# EAGLE design QFP32forZIF (EAGLE 6.3)
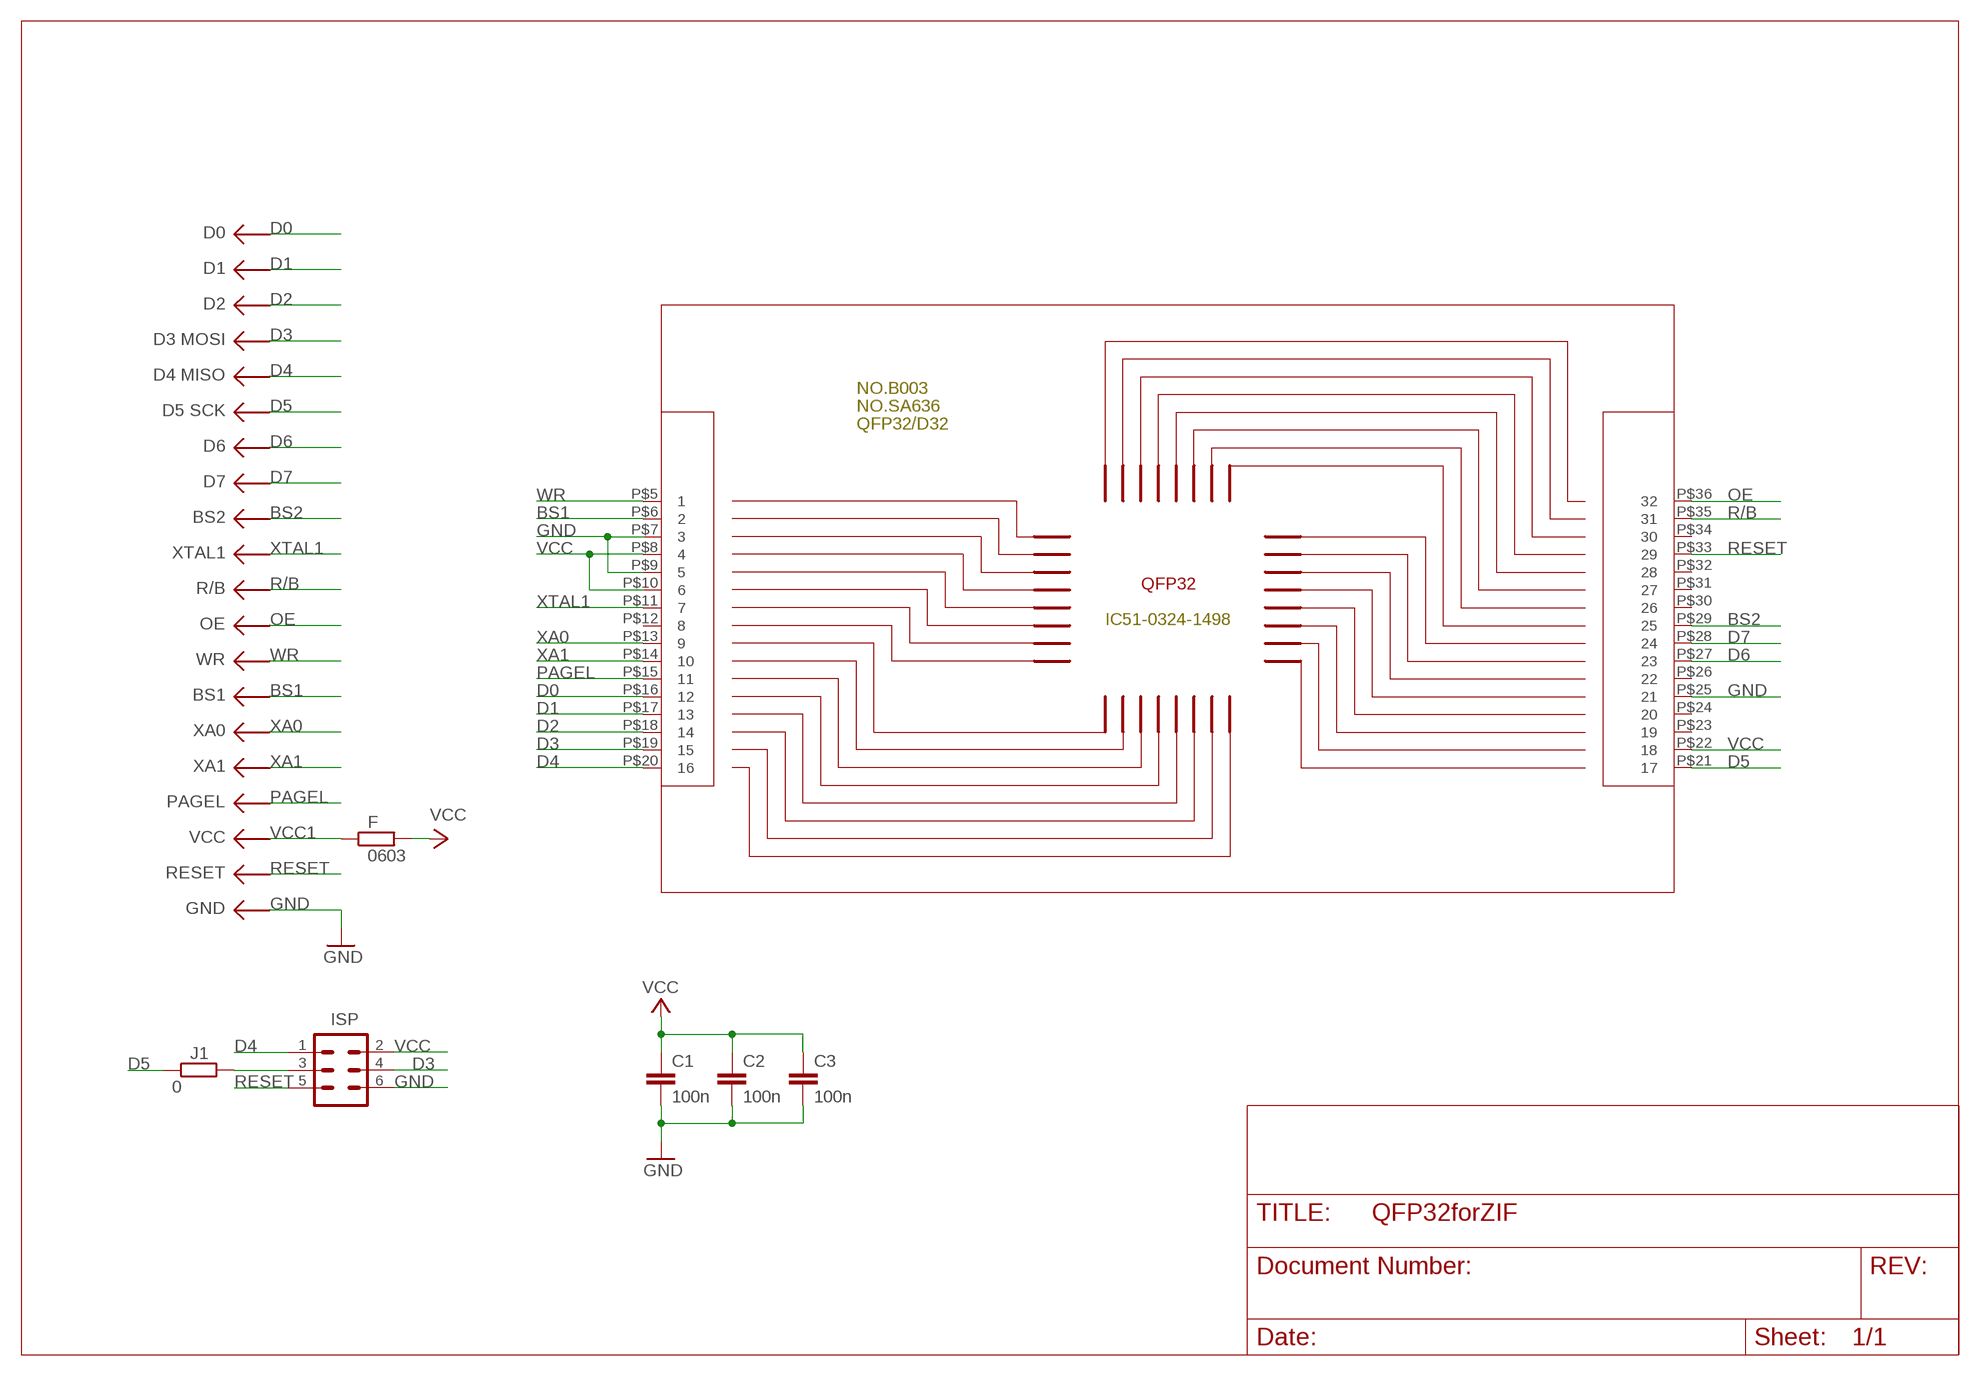
[diagram p0: schematic, sheet 1]

## Parts
C1  100n  RCL_C-EUC0805  [RCL_C0805]
C2  100n  RCL_C-EUC0805  [RCL_C0805]
C3  100n  RCL_C-EUC0805  [RCL_C0805]
F  0603  RCL_R-EU_M0805  [RCL_M0805]
ISP  MA03-2  [MA03-2]
J1  0  R-EU_R1206W  [R1206W]
U$1  PROGRAMMER_P_AVR  [PROGRAMMER_P_AVR]
U$14  SA636-40  [ADAPTERQFP48FORZIF]

## Nets
BS1: U$1.BS1 U$14.P$6
BS2: U$1.BS2 U$14.P$29
D0: U$1.D0 U$14.P$16
D1: U$1.D1 U$14.P$17
D2: U$1.D2 U$14.P$18
D3: ISP.4 U$1.D3 U$14.P$19
D4: ISP.1 U$1.D4 U$14.P$20
D5: J1.1 U$1.D5 U$14.P$21
D6: U$1.D6 U$14.P$27
D7: U$1.D7 U$14.P$28
GND: C1.2 C2.2 C3.2 ISP.6 U$1.GND U$1.GND01(GND) U$1.GND2(GND) U$1.GND03(GND) U$1.GND04(GND) U$1.GND05(GND) U$1.GND06(GND) U$1.GND07(GND) U$1.GND08(GND) U$1.GND09(GND) U$1.GND10(GND) U$1.GND11(GND) U$1.GND12(GND) U$1.GND13(GND) U$1.GND14(GND) U$1.GND15(GND) U$1.GND16(GND) U$1.GND17(GND) U$1.GND18(GND) U$1.GND19(GND) U$1.GND20(GND) U$1.GND21(GND) U$1.GND22(GND) U$14.P$7 U$14.P$9 U$14.P$25
N$6: ISP.3 J1.2
OE: U$1.OE U$14.P$36
PAGEL: U$1.PAGEL U$14.P$15
R/B: U$1.RB U$14.P$35
RESET: ISP.5 U$1.RESET U$14.P$33
VCC: C1.1 C2.1 C3.1 F.2 ISP.2 U$14.P$8 U$14.P$10 U$14.P$22
VCC1: F.1 U$1.VCC
WR: U$1.WR U$14.P$5
XA0: U$1.XA0 U$14.P$13
XA1: U$1.XA1 U$14.P$14
XTAL1: U$1.XTAL1 U$14.P$11
Unconnected: U$14.P$12 U$14.P$23 U$14.P$24 U$14.P$26 U$14.P$30 U$14.P$31 U$14.P$32 U$14.P$34

## Notes on the sheet
- NO.B003
- NO.SA636
- QFP32/D32
- IC51-0324-1498

## Library data of the parts
C1-C3 = HWProgUSB:RCL_C-EU: CAPACITOR, European symbol
F = HWProgUSB:RCL_R-EU_: RESISTOR, European symbol
ISP = con-lstb:MA03-2: PIN HEADER
J1 = rcl:R-EU_: RESISTOR, European symbol
U$1 = AdapterDIP_P:PROGRAMMER_P_AVR
U$14 = QFP32forZIF:SA636-40

## Board
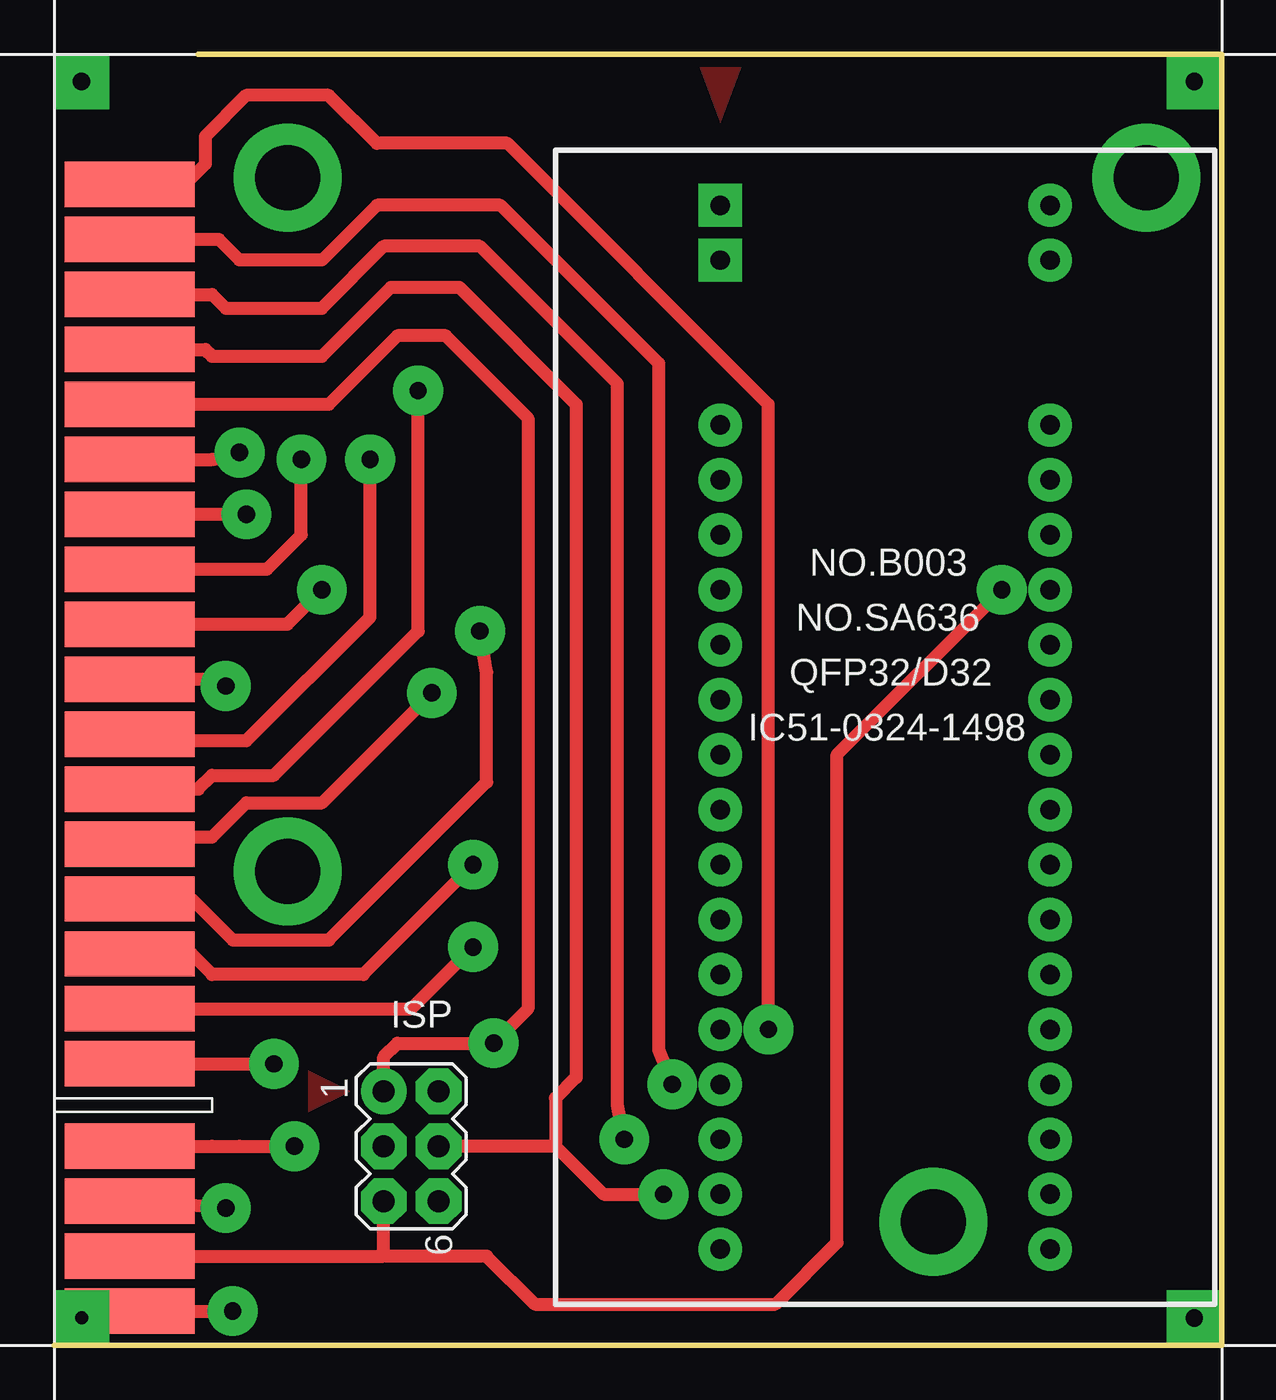
[diagram p1: board, top side]
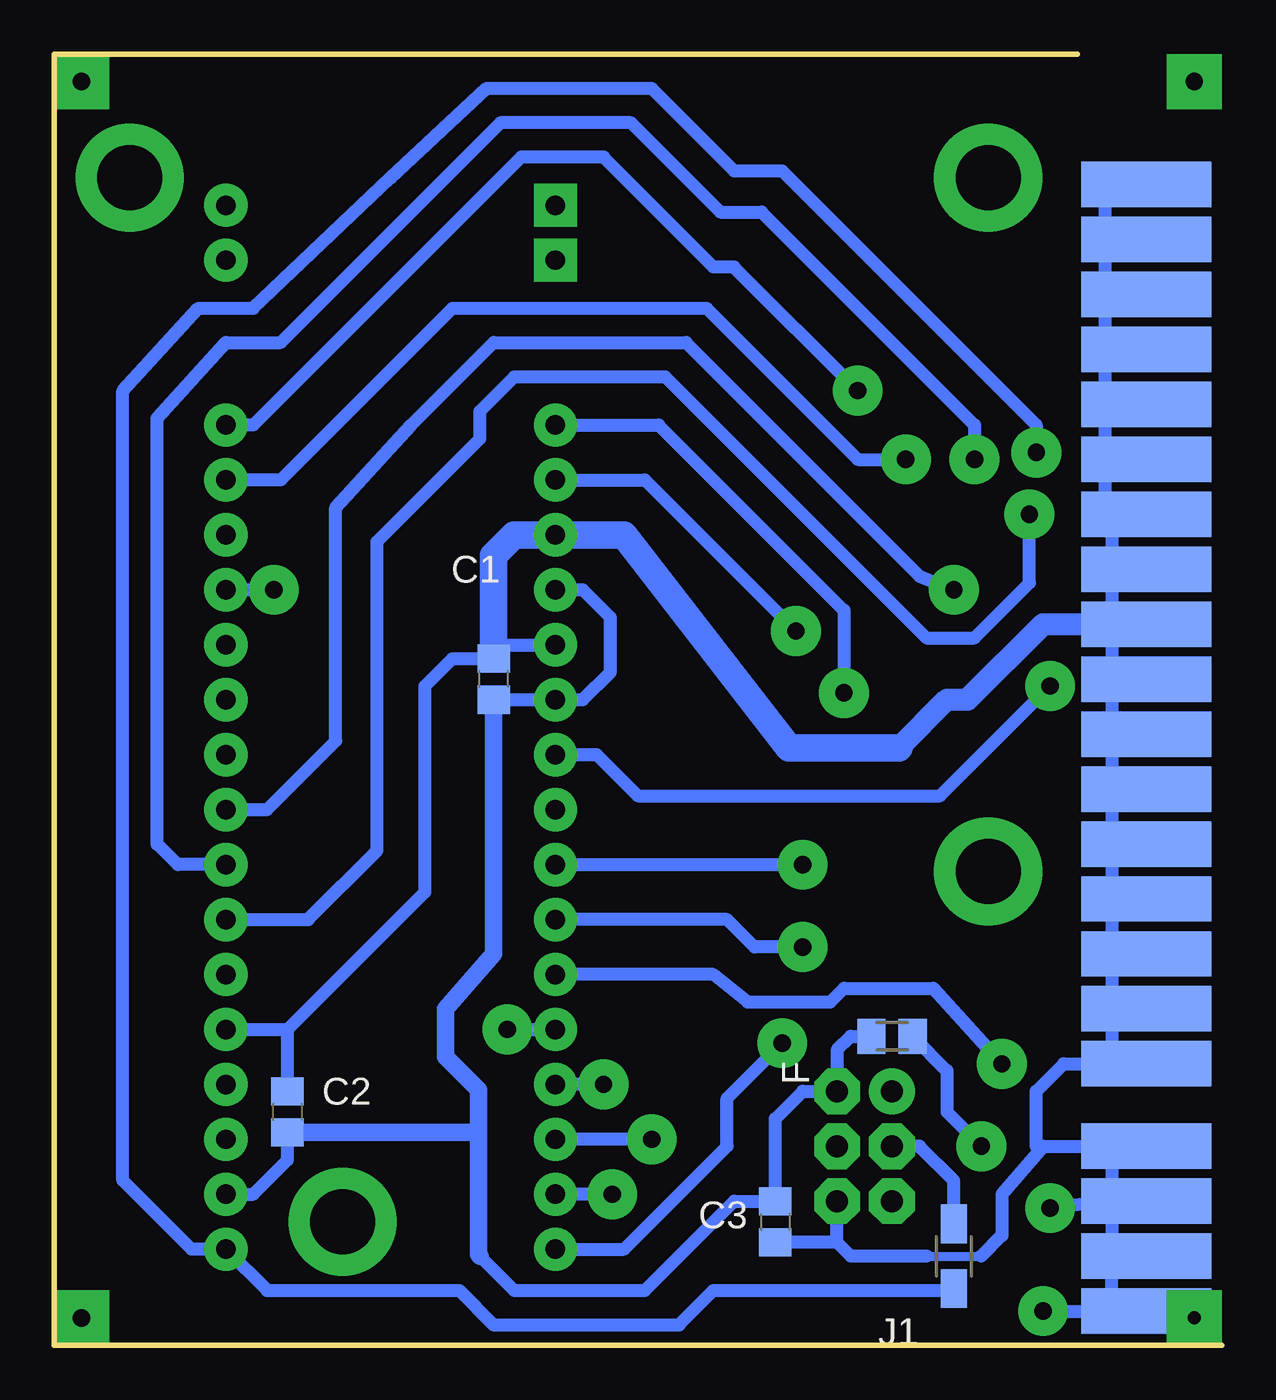
[diagram p2: board, bottom side, seen from below]

Size 53.98 x 59.69 mm. Coordinates in mm from the lower left corner, seen from the top.
Outline: 6.67,59.69 53.98,59.69 53.98,0 0,0
Copper layers (1*16): Top 0.035mm / dielectric 1.5mm / Bottom 0.035mm
Design rules "DesignRules": minimum track width 8mil, minimum drill 24mil, track to track 0.2mm, track to pad 0.2mm, pad to pad 8mil, via to via 8mil, smd to smd 8mil, copper to edge 10mil, drill to drill 8mil, minimum pad ring 0.55mm, minimum via ring 8mil, stop-mask expansion 4mil, vias tented up to drill 0mil, thermal gap 10mil

### Footprints (pad centres in the part's own frame; a part is rotated, then mirrored left to right if it is on the bottom)
RCL_C0805 = smd 1.3 x 1.5: 1 -0.95,0; 2 0.95,0
RCL_M0805 = smd 1.3 x 1.6: 1 -0.95,0; 2 0.95,0
MA03-2 = drill 1.016: 1 -2.54,-1.27 | drill 1.016 octagon: 2 -2.54,1.27; 3 0,-1.27; 4 0,1.27; 5 2.54,-1.27; 6 2.54,1.27
R1206W = smd 1.8 x 1.2: 1 -1.499,0; 2 1.499,0
PROGRAMMER_P_AVR = smd 2.1 x 6: BS1 37.782,-0.318; BS2 25.082,-0.318; D0 4.763,-0.318; D1 7.303,-0.318; D2 9.842,-0.318; D3 12.383,-0.318; D4 14.922,-0.318; D5 17.462,-0.318; D6 20.003,-0.318; D7 22.543,-0.318; GND 51.752,-0.318; GND2 56.833,-0.318; OE 32.703,-0.318; PAGEL 45.403,-0.318; RB 30.163,-0.318; RESET 54.292,-0.318; VCC 49.212,-0.318; WR 35.242,-0.318; XA0 40.322,-0.318; XA1 42.862,-0.318; XTAL1 27.622,-0.318 | smd 2.1 x 6 bottom: GND01 4.763,-0.318; GND03 7.303,-0.318; GND04 9.842,-0.318; GND05 12.383,-0.318; GND06 14.922,-0.318; GND07 17.462,-0.318; GND08 20.003,-0.318; GND09 22.543,-0.318; GND10 25.082,-0.318; GND11 27.622,-0.318; GND12 30.163,-0.318; GND13 32.703,-0.318; GND14 35.242,-0.318; GND15 37.782,-0.318; GND16 40.322,-0.318; GND17 42.862,-0.318; GND18 45.403,-0.318; GND19 49.212,-0.318; GND20 51.752,-0.318; GND21 54.292,-0.318; GND22 56.833,-0.318
ADAPTERQFP48FORZIF = drill 0.9 square: P$1 -7.62,22.86; P$2 -7.62,20.32 | drill 0.9: P$5 -7.62,12.7; P$6 -7.62,10.16; P$7 -7.62,7.62; P$8 -7.62,5.08; P$9 -7.62,2.54; P$10 -7.62,0; P$11 -7.62,-2.54; P$12 -7.62,-5.08; P$13 -7.62,-7.62; P$14 -7.62,-10.16; P$15 -7.62,-12.7; P$16 -7.62,-15.24; P$17 -7.62,-17.78; P$18 -7.62,-20.32; P$19 -7.62,-22.86; P$20 -7.62,-25.4; P$21 7.62,-25.4; P$22 7.62,-22.86; P$23 7.62,-20.32; P$24 7.62,-17.78; P$25 7.62,-15.24; P$26 7.62,-12.7; P$27 7.62,-10.16; P$28 7.62,-7.62; P$29 7.62,-5.08; P$30 7.62,-2.54; P$31 7.62,0; P$32 7.62,2.54; P$33 7.62,5.08; P$34 7.62,7.62; P$35 7.62,10.16; P$36 7.62,12.7; P$39 7.62,20.32; P$40 7.62,22.86

### Placement (x,y rotation side)
C1  33.66,30.8 90 bottom
C2  43.18,10.8 90 bottom
C3  20.64,5.71 270 bottom
F  15.24,14.29 180 bottom
ISP  16.51,9.21 270 top
J1  12.38,4.13 90 bottom
U$1  3.81,58.42 270 top
U$14  38.42,29.85 0 top

### Tracks (layer width: path | path; a pad name or v marks a point on that pad's centre or on a via)
BS1  (via drill 0.8 pad 2.3)
  Top 0.61: v19.68,33.02 20,31.11 20,26.03 12.7,18.73 8.25,18.73 6.35,20.64 U$1.BS1
  Bottom 0.61: U$14.P$6 26.67,40 v19.68,33.02
BS2  (via drill 0.8 pad 2.3)
  Top 0.61: U$1.BS2 10.8,33.34 v12.38,34.93
  Bottom 0.61: U$14.P$29 44.13,24.76 40.96,27.94 40.96,38.74 37.47,42.54 33.66,46.35 24.77,46.35 13.97,35.56 v12.38,34.93
D0  (via drill 0.8 pad 2.3)
  Top 0.61: U$1.D0 6.03,53.66 6.98,54.61 6.98,55.88 8.89,57.79 12.7,57.79 14.92,55.56 20.95,55.56 33.02,43.5 v33.02,14.6
  Bottom 0.61: v33.02,14.6 U$14.P$16
D1  (via drill 0.8 pad 2.3)
  Top 0.61: U$1.D1 7.62,51.12 8.57,50.17 12.38,50.17 14.92,52.71 20.64,52.71 27.94,45.4 27.94,13.65 v28.58,12.07
  Bottom 0.61: v28.58,12.07 U$14.P$17
D2  (via drill 0.8 pad 2.3)
  Top 0.61: v26.35,9.53 26.04,11.11 26.04,44.45 19.68,50.8 15.24,50.8 12.38,47.94 7.94,47.94 7.3,48.58 U$1.D2
  Bottom 0.61: v26.35,9.53 U$14.P$18
D3  (via drill 0.8 pad 2.3)
  Top 0.61: 23.18,9.21 25.4,6.98 v28.17,6.98 | 23.18,9.21 ISP.4 | 23.18,9.21 23.18,11.43 24.13,12.38 24.13,43.5 18.73,48.89 15.56,48.89 12.38,45.72 7.3,45.72 6.98,46.04 U$1.D3
  Bottom 0.61: v28.17,6.98 U$14.P$19
D4  (via drill 0.8 pad 2.3)
  Top 0.61: ISP.1 15.24,13.34 15.88,13.97 v20.32,13.97 21.91,15.56 21.91,42.86 18.1,46.67 15.88,46.67 12.7,43.5 U$1.D4
  Bottom 0.61: U$14.P$20 27.62,4.44 22.86,9.21 22.86,11.43 v20.32,13.97
D5  (via drill 0.8 pad 2.3)
  Top 0.61: U$1.D5 7.3,40.96 v8.57,41.28
  Bottom 0.61: J1.1 12.07,2.54 23.49,2.54 25.08,0.95 33.66,0.95 35.24,2.54 44.13,2.54 U$14.P$21 47.62,4.44 50.8,7.62 50.8,44.13 47.31,47.94 44.77,47.94 38.42,53.97 33.97,58.1 26.35,58.1 22.54,54.29 20.32,54.29 8.57,42.54 v8.57,41.28
D6  (via drill 0.8 pad 2.3)
  Top 0.61: U$1.D6 v8.89,38.42
  Bottom 0.61: U$14.P$27 42.23,19.68 39.05,22.86 39.05,37.15 34.29,41.91 34.29,43.18 32.7,44.77 25.72,44.77 13.65,32.7 11.43,32.7 8.89,35.24 v8.89,38.42
D7  (via drill 0.8 pad 2.3)
  Top 0.61: U$1.D7 9.84,35.88 11.43,37.46 v11.43,40.96
  Bottom 0.61: U$14.P$28 48.26,22.23 49.21,23.18 49.21,42.86 46.04,46.35 43.5,46.35 33.34,56.51 27.3,56.51 23.18,52.39 21.27,52.39 11.43,42.54 v11.43,40.96
GND  (via drill 0.8 pad 2.3)
  Top 0.61: v7.94,6.35 U$1.GND | U$1.GND22 v8.25,1.59
  Bottom 0.406: 13.65,4.13 11.11,4.13
  Bottom 0.61: U$14.P$9 33.66,32.39 C1.2 35.56,31.75 36.83,30.48 36.83,20.96 43.18,14.6 | U$14.P$25 43.18,14.6 | 8.25,9.21 8.57,9.21 8.57,11.75 7.3,13.02 5.08,13.02 | 8.25,9.21 5.08,9.21 | 5.08,6.67 v7.94,6.35 | 13.65,4.13 17.14,4.13 17.78,4.76 | 17.78,4.76 ISP.6 | C2.2 43.18,14.6 | 17.78,4.76 C3.2 | U$1.GND01 5.4,53.66 5.4,51.12 | U$1.GND03 5.4,51.12 | 5.4,51.12 5.4,48.58 | U$1.GND04 5.4,48.58 | 5.4,48.58 5.4,46.04 | U$1.GND05 5.4,46.04 | 5.4,46.04 5.4,43.5 | U$1.GND06 5.4,43.5 | 5.4,43.5 5.4,40.96 | U$1.GND07 5.4,40.96 | 5.4,40.96 5.4,38.42 5.08,38.42 | U$1.GND08 5.08,38.42 | 5.08,38.42 5.08,35.88 | U$1.GND09 5.08,35.88 | 5.08,35.88 5.08,33.34 5.08,30.8 | U$1.GND11 5.08,30.8 | 5.08,30.8 5.08,28.26 | U$1.GND12 5.08,28.26 | 5.08,28.26 5.08,25.72 | U$1.GND13 5.08,25.72 | 5.08,25.72 5.08,23.18 | U$1.GND14 5.08,23.18 | 5.08,23.18 5.08,20.64 | U$1.GND15 5.08,20.64 | 5.08,20.64 5.08,18.1 | U$1.GND16 5.08,18.1 | 5.08,18.1 5.08,15.56 | U$1.GND17 5.08,15.56 | 5.08,15.56 5.08,13.02 | 5.08,13.02 U$1.GND18 | U$1.GND19 5.08,9.21 | 5.08,9.21 5.08,6.67 | U$1.GND 5.08,6.67 | 5.08,6.67 5.08,4.13 | 5.08,4.13 U$1.GND21 | U$1.GND22 5.08,1.59 | 5.08,1.59 5.08,4.13 | v8.25,1.59 5.08,1.59 | 8.25,9.21 10.16,6.98 10.16,5.08 11.11,4.13
  Bottom 1.016: 14.92,27.62 12.7,29.85 11.75,29.85 8.25,33.34 5.08,33.34 U$1.GND10
  Bottom 1.27: 14.92,27.62 20,27.62 27.62,37.46 U$14.P$7 32.7,37.46 33.66,36.51 33.66,32.39
N$1  (via drill 0.8 pad 2.54)
  other vias: 1.27,58.42
N$2  (via drill 0.8 pad 2.54)
  other vias: 52.71,58.42
N$3  (via drill 0.8 pad 2.54)
  other vias: 52.71,1.27
N$4  (via drill 0.6 pad 2.54)
  other vias: 1.27,1.27
N$5
  pour Top: 13.65,11.75 11.75,12.7 11.75,10.8
N$6
  Bottom 0.61: J1.2 12.38,7.62 13.97,9.21 ISP.3
N$7
  pour Top: 30.8,56.52 31.75,59.06 29.84,59.06
N$8  (via drill 3 pad 5)
  other vias: 50.48,53.97
N$9  (via drill 3 pad 5)
  other vias: 40.64,5.71
N$10  (via drill 3 pad 5)
  other vias: 10.8,21.91
N$11  (via drill 3 pad 5)
  other vias: 10.8,53.97
OE  (via drill 0.8 pad 2.3)
  Top 0.61: v16.83,44.13 16.83,33.02 10.16,26.35 7.3,26.35 6.67,25.72 U$1.OE
  Bottom 0.61: U$14.P$36 44.77,42.54 32.38,54.93 28.58,54.93 23.49,49.85 22.54,49.85 v16.83,44.13
PAGEL  (via drill 0.8 pad 2.3)
  Top 0.61: U$1.PAGEL v10.16,13.02
  Bottom 0.61: U$14.P$15 23.49,17.14 21.91,15.87 18.1,15.87 17.46,16.51 13.34,16.51 v10.16,13.02
R/B  (via drill 0.8 pad 2.3)
  Top 0.61: v14.61,40.96 14.61,33.65 8.89,27.94 6.35,27.94 6.03,28.26 U$1.RB
  Bottom 0.61: U$14.P$35 43.5,40 35.56,47.94 23.81,47.94 16.83,40.96 v14.61,40.96
RESET  (via drill 0.8 pad 2.3)
  Top 0.61: U$1.RESET 15.24,4.13 | 15.24,4.13 ISP.5 | 15.24,4.13 20,4.13 22.23,1.91 33.34,1.91 36.2,4.76 36.2,27.31 v43.81,34.93
  Bottom 0.61: v43.81,34.93 U$14.P$33
VCC
  Bottom 0.61: 34.29,4.13 32.7,2.54 26.67,2.54 22.55,6.67 C3.1 20.64,10.48 19.37,11.75 ISP.2 17.78,13.65 17.14,14.29 F.2 | U$14.P$8 29.53,34.93 28.26,33.65 28.26,31.11 29.53,29.85 U$14.P$10 32.7,29.85 C1.1 | U$14.P$22 44.77,6.98 43.18,8.57 C2.1
  Bottom 0.813: C2.1 34.37,9.84 34.36,9.85 | 34.29,4.13 34.36,4.2 34.36,9.85 | 34.36,9.85 34.36,11.82 35.88,13.34 35.88,15.56 33.66,18.1 C1.1
VCC1  (via drill 0.8 pad 2.3)
  Top 0.61: U$1.VCC 2.86,8.89 3.18,8.89 3.18,9.21 7.3,9.21 8.57,9.21 v11.11,9.21
  Bottom 0.61: F.1 12.7,12.7 12.7,10.8 v11.11,9.21
WR  (via drill 0.8 pad 2.3)
  Top 0.61: U$1.WR 3.18,23.5 7.3,23.5 8.89,25.08 12.38,25.08 v17.46,30.16
  Bottom 0.61: v17.46,30.16 17.46,33.97 26.04,42.54 U$14.P$5
XA0  (via drill 0.8 pad 2.3)
  Top 0.61: v19.37,22.23 14.29,17.14 7.3,17.14 6.35,18.1 U$1.XA0
  Bottom 0.61: U$14.P$13 v19.37,22.23
XA1  (via drill 0.8 pad 2.3)
  Top 0.61: U$1.XA1 16.51,15.56 v19.37,18.41
  Bottom 0.61: v19.37,18.41 21.59,18.41 22.86,19.68 U$14.P$14
XTAL1  (via drill 0.8 pad 2.3)
  Top 0.61: U$1.XTAL1 7.62,30.8 v7.94,30.48
  Bottom 0.61: U$14.P$11 28.89,27.31 26.99,25.4 13.02,25.4 v7.94,30.48